# EAGLE design ComboBreaker (EAGLE 7.2.0)
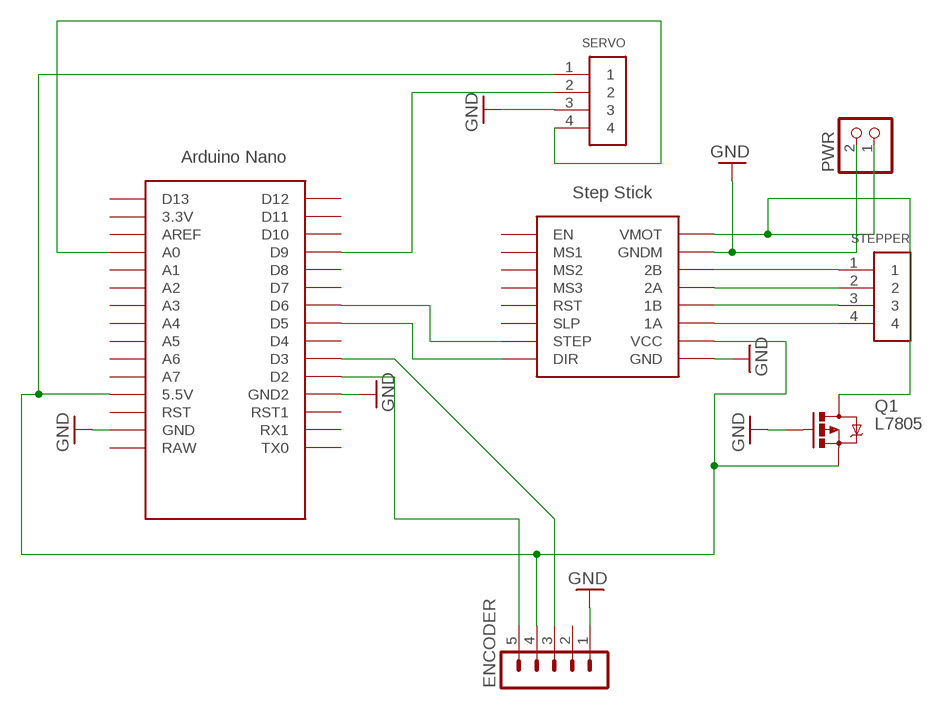
[diagram p0: schematic, sheet 1]

## Parts
ENCODER  MA05-1  [MA05-1]
PWR  JST_2PIN-SMT  [JST-PH-2-SMT]
Q1  L7805  MOSFET-PCHANNELFQP27P06  [TO220V]
SERVO  1X4-BIG  [1X04-BIG]
STEPPER  1X4-BIG  [1X04-BIG]
U$1  NANO  [NANO]
U$2  STEP-STICK  [STEP-STICK]

## Nets
GND: ENCODER.1 PWR.2 Q1.1(G) SERVO.3 U$1.GND U$1.GND1(GND2) U$2.GND U$2.GNDM
N$1: SERVO.2 U$1.D9
N$2: U$1.D5 U$2.DIR
N$3: U$1.D6 U$2.SPT(STEP)
N$4: PWR.1 Q1.2(D) U$2.VMOT
N$5: STEPPER.2 U$2.2A
N$6: STEPPER.1 U$2.2B
N$7: STEPPER.4 U$2.1A
N$8: STEPPER.3 U$2.1B
N$9: SERVO.4 U$1.A0
N$10: ENCODER.5 U$1.D2
N$11: ENCODER.4 Q1.3(S) SERVO.1 U$1.5V(5.5V) U$2.VCC
N$12: ENCODER.3 U$1.D3
Unconnected: ENCODER.2 U$1.3.3V U$1.A1 U$1.A2 U$1.A3 U$1.A4 U$1.A5 U$1.A6 U$1.A7 U$1.AREF U$1.D4 U$1.D7 U$1.D8 U$1.D10 U$1.D11 U$1.D12 U$1.D13 U$1.ICSP1 U$1.ICSP2 U$1.ICSP3 U$1.ICSP4 U$1.ICSP5 U$1.ICSP6 U$1.RAW U$1.RST U$1.RST1 U$1.RX1 U$1.TX0 U$2.EN U$2.MS1 U$2.MS2 U$2.MS3 U$2.RST U$2.SLP

## Library data of the parts
ENCODER = con-lstb:MA05-1: PIN HEADER; OC_FARNELL: unknown; OC_NEWARK: unknown
PWR = adafruit:JST_2PIN: JST 2-Pin Connectors of various flavors SMT-RA (S2B-PH-SM4) 4UConnector #17311 SMT (B2B-PH-SM4) THM-RA (S2B-PH) THM (B2B-PH)
Q1 = User-Submitted:MOSFET-PCHANNEL: Generic PMOSFET IRLML2244 - TRANS-11153 (SOT-23 -20V -4.3A) (1.Gate 2.Source 3.Drain) FQP27P06 - COM-10349 <http://www.sparkfun.com/products/10349> (TO-220 -60V -27A) (1.Gate 2.Source 3.Drain)
SERVO STEPPER = adafruit:1X4: 4-pin connector
U$1 = Arduino-clone:NANO: Arduino Nano
U$2 = Arduino-clone:STEP-STICK

## Board
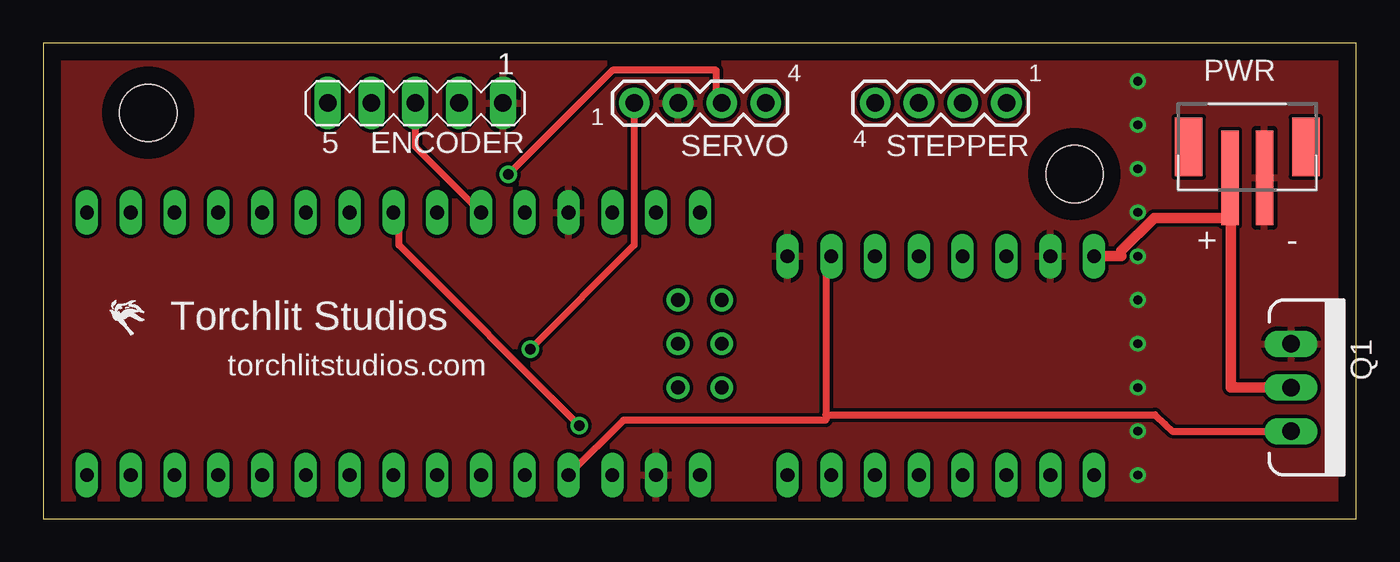
[diagram p1: board, top side]
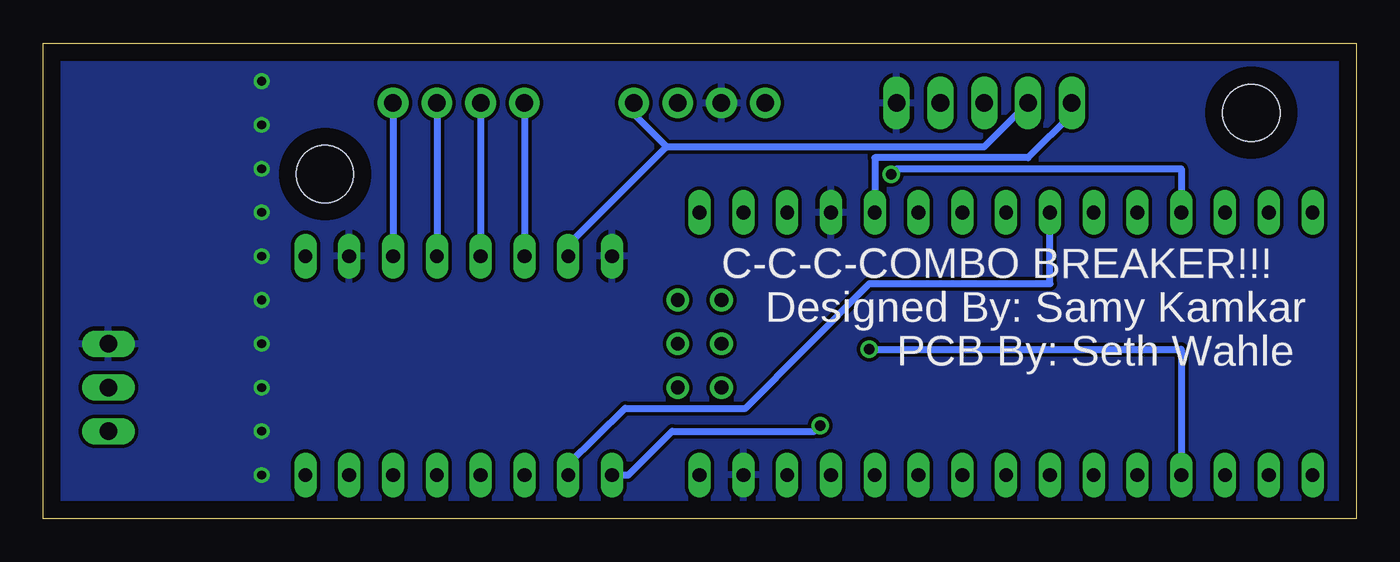
[diagram p2: board, bottom side, seen from below]

Size 76.18 x 27.61 mm. Coordinates in mm from the lower left corner, seen from the top.
Outline: 0,0 76.18,0 76.18,27.61 0,27.61 0,0
Copper layers (1*16): Top 0.035mm / dielectric 1.5mm / Bottom 0.035mm
Design rules "default": minimum track width 10mil, minimum drill 24mil, track to track 8mil, track to pad 8mil, pad to pad 8mil, via to via 8mil, smd to smd 8mil, copper to edge 40mil, drill to drill 8mil, minimum pad ring 10mil, minimum via ring 8mil, stop-mask expansion 4mil, vias tented up to drill 0mil, thermal gap 10mil

### Footprints (pad centres in the part's own frame; a part is rotated, then mirrored left to right if it is on the bottom)
MA05-1 = drill 1.016 long: 1 -5.08,0; 2 -2.54,0; 3 0,0; 4 2.54,0; 5 5.08,0
JST-PH-2-SMT = smd 1 x 5.5: 1 -1,-1.8; 2 1,-1.8 | smd 1.6 x 3.4: NC1 -3.4,0; NC2 3.4,0
TO220V = drill 1.016 long: 1 -2.54,0; 2 0,0; 3 2.54,0
1X04-BIG = drill 1.016 pad 1.778: 1 0,0; 2 2.54,0; 3 5.08,0; 4 7.62,0
NANO = drill 0.8 long: 3.3V -10.16,24.13; 5V -10.16,-1.27; A0 -10.16,19.05; A1 -10.16,16.51; A2 -10.16,13.97; A3 -10.16,11.43; A4 -10.16,8.89; A5 -10.16,6.35; A6 -10.16,3.81; A7 -10.16,1.27; AREF -10.16,21.59; D2 5.08,1.27; D3 5.08,3.81; D4 5.08,6.35; D5 5.08,8.89; D6 5.08,11.43; D7 5.08,13.97; D8 5.08,16.51; D9 5.08,19.05; D10 5.08,21.59; D11 5.08,24.13; D12 5.08,26.67; D13 -10.16,26.67; GND -10.16,-6.35; GND1 5.08,-1.27; RAW -10.16,-8.89; RST -10.16,-3.81; RST1 5.08,-3.81; RX1 5.08,-6.35; TX0 5.08,-8.89 | drill 0.8: ICSP1 -5.08,-10.16; ICSP2 -5.08,-7.62; ICSP3 -2.54,-10.16; ICSP4 -2.54,-7.62; ICSP5 0,-10.16; ICSP6 0,-7.62
STEP-STICK = drill 0.8 long: 1A -8.89,-7.62; 1B -8.89,-5.08; 2A -8.89,-2.54; 2B -8.89,0; DIR 3.81,-12.7; EN 3.81,5.08; GND -8.89,-12.7; GNDM -8.89,2.54; MS1 3.81,2.54; MS2 3.81,0; MS3 3.81,-2.54; RST 3.81,-5.08; SLP 3.81,-7.62; SPT 3.81,-10.16; VCC -8.89,-10.16; VMOT -8.89,5.08
STAND-OFF = hole 3.302: 0,0

### Placement (x,y rotation side)
ENCODER  21.59,24.13 180 top
PWR  69.85,21.59 0 top
Q1  72.39,7.62 270 top
SERVO  41.91,24.13 180 top
STEPPER  55.88,24.13 180 top
U$1  29.21,12.7 90 top
U$2  55.88,6.35 270 top
U$3  [STAND-OFF]  6.1,23.56 0 top
U$4  [STAND-OFF]  59.83,20.01 0 top

### Tracks (layer width: path | path; a pad name or v marks a point on that pad's centre or on a via)
GND  (via drill 0.5)
  other vias: 63.5,25.4 63.5,22.86 63.5,20.32 63.5,17.78 63.5,15.24 63.5,12.7 63.5,10.16 63.5,7.62 63.5,5.08 63.5,2.54
  pour Bottom: 0,0 76.2,0 76.2,27.94 0,27.94
  pour Top: 0,27.94 76.2,27.94 76.2,0 0,0
N$1  (via drill 0.61)
  Top 0.406: v26.99,20 33.02,26.04 39.05,26.04 39.05,24.45 SERVO.2
  Bottom 0.406: U$1.D9 10.16,20.32 26.67,20.32 v26.99,20
N$2  (via drill 0.61)
  Top 0.406: U$1.D5 20.64,17.46 20.64,15.88 v31.11,5.4
  Bottom 0.254: 31.43,5.08 v31.11,5.4
  Bottom 0.406: 31.43,5.08 39.69,5.08 42.23,2.54 U$2.DIR
N$3
  Bottom 0.406: U$1.D6 17.78,13.65 28.26,13.65 35.43,6.42 42.42,6.42 45.72,3.17 U$2.SPT
N$4
  Top 0.254: 62.55,15.56 62.55,15.24 | 68.58,17.46 68.58,19.68 PWR.1 68.9,19.68
  Top 0.61: 62.55,15.24 U$2.VMOT | 62.55,15.56 64.45,17.46 68.58,17.46 | Q1.2 68.9,7.62 68.9,19.68
N$5
  Bottom 0.406: STEPPER.2 U$2.2A
N$6
  Bottom 0.406: STEPPER.1 U$2.2B
N$7
  Bottom 0.406: STEPPER.4 U$2.1A
N$8
  Bottom 0.406: STEPPER.3 U$2.1B
N$9  (via drill 0.61)
  Top 0.406: v28.26,9.84 34.29,15.88 SERVO.4
  Bottom 0.406: U$1.A0 10.16,9.84 v28.26,9.84
N$10
  Bottom 0.254: ENCODER.5 16.51,23.5
  Bottom 0.406: U$1.D2 27.94,20.95 19.05,20.95 16.51,23.5
N$11
  Top 0.254: U$2.VCC 45.4,14.92
  Top 0.406: U$1.5V 33.66,5.71 45.4,5.71 45.4,6.03 | 45.4,14.92 45.4,6.03 | Q1.3 65.5,5.08 65.07,5.48 64.5,6.03 45.4,6.03
  Bottom 0.254: SERVO.1 41.91,23.5 | U$2.VCC 45.72,15.88
  Bottom 0.406: ENCODER.4 21.59,21.59 40.01,21.59 | 41.91,23.5 40.01,21.59 | 45.72,15.88 40.01,21.59
N$12
  Top 0.406: U$1.D3 21.59,21.59 ENCODER.3

### Text on the board
tPlace: Torchlit Studios | torchlitstudios.com
tNames: 4 | 1 | 1 | 4
bNames: C-C-C-COMBO BREAKER!!! | Designed By: Samy Kamkar | PCB By: Seth Wahle